# Altium schematic sheet Power.SchDoc
size A; SheetNumber: 4; SheetTotal: 10
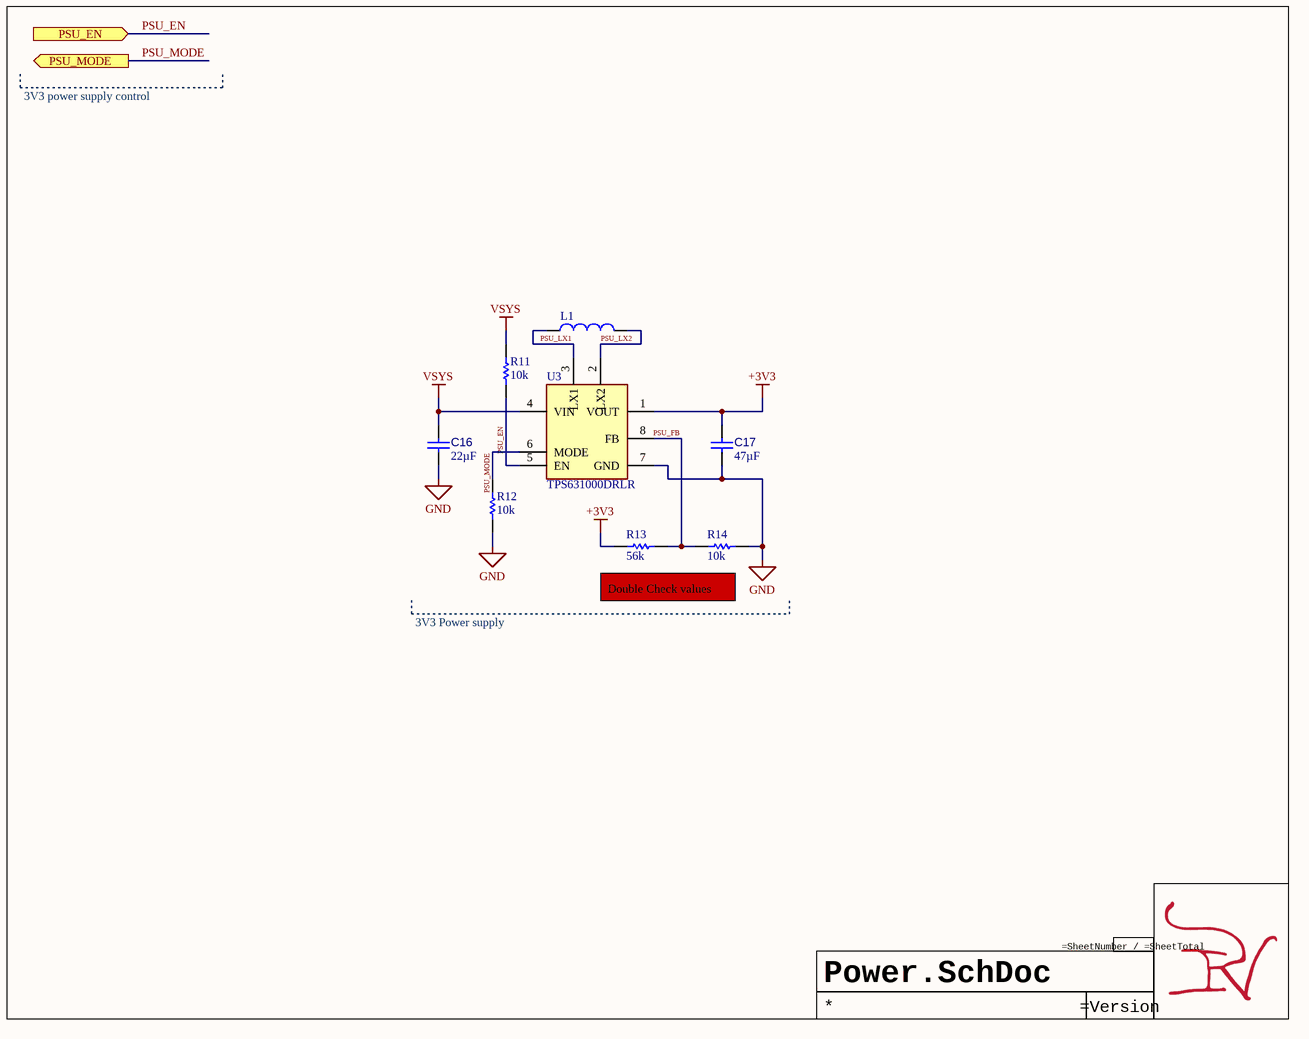
[diagram p0: Power.SchDoc]

## Parts
C16  value 22µF  [CAP 0603_1608]  (hidden comment: CL10A226KQ8NRNE)
C17  value 47µF  [CAP 0805_2012]  (hidden comment: CL21A476MQYNNNE)
L1  CIGT252010EH1R0MNE  [FP-CIGT252010EH1R0MNE-MFG]  (value not drawn)
R11  value 10k  [RES 0201_0603]  (hidden comment: 10k-0201-0.05/1)
R12  value 10k  [RES 0201_0603]  (hidden comment: 10k-0201-0.05/1)
R13  value 56k  [RES 0201_0603]  (hidden comment: 56k-0204-0.05/1)
R14  value 10k  [RES 0201_0603]  (hidden comment: 10k-0201-0.05/1)
U3  TPS631000DRLR  [SOTFL50P160X60-8N]

## Ports
PSU_EN (in, see 2040Macro-PCB[2C]), PSU_MODE (out, see 2040Macro-PCB[2C])

## Nets
+3V3: C17.2 R13.1 U3.1(VOUT)
GND: C16.1 C17.1 R12.2 R14.2 U3.7(GND)
VSYS: C16.2 R11.2 U3.4(VIN)
PSU_EN: R11.1 U3.5(EN) ; port PSU_EN
PSU_FB: R13.2 R14.1 U3.8(FB)
PSU_LX1: L1.1 U3.3(LX1)
PSU_LX2: L1.2 U3.2(LX2)
PSU_MODE: R12.1 U3.6(MODE) ; port PSU_MODE

## Notes on the sheet
- 3V3 power supply control
- 3V3 Power supply
- Double Check values

## Library data of the parts
C16 = CMP-001-00044-1: Ceramic Capacitor, Multilayer, Ceramic, 6.3V, 10% +Tol, 10% -Tol, X5R, 15% TC, 22uF, Surface Mount, 0603; Multilayer: Yes; Case/Package: 0603; Temperature Characteristics Code: X5R; JESD-609 Code: e3; Capacitor Type: Ceramic; Pins: 2; Rated DC Voltage (URdc): 6.3V; Package Style: SMTMeter; Reach SVHC Compliant: Yes; Height: 0.8mm; Tolerance  (fill in as +-): 10%; Terminal Finish: Nickel; Tolerance (fill in as +-): 10%; Max Operating Temperature: 85°C; Mounting Technology: Surface Mount; Dielectric Material: Ceramic; Width: 0.8mm; Length: 1.6mm; Min Operating Temperature: -55°C; Termination: Wraparound; Packaging: Tape and Reel; Package Shape: Rectangular; RoHS Compliant: Yes
C17 = CMP-001-00013-1: Ceramic Capacitor, Multilayer, Ceramic, 6.3V, 20% +Tol, 20% -Tol, X5R, 15% TC, 47uF, Surface Mount, 0805; Mounting Technology: Surface Mount; Max Operating Temperature: 85°C; Pins: 2; RoHS Compliant: Yes; Min Operating Temperature: -55°C; Capacitor Type: Ceramic; Case/Package: 0805
L1 = CMP-006-00002-1: General Purpose Inductor, 1uH, 20%, 1 Element, Metal Composite-Core, SMD; Test Frequency: 1MHz; Shielding: Unshielded; Core Material: Metal,Composite; Shape/Size Description: RECTANGULAR PACKAGE; DC Resistance (DCR): 30mR; Inductor Application: POWER INDUCTOR; Channels: 1; Max Current Rating: 4.1A; Termination: Wraparound; RoHS Compliant: Yes; Terminal Placement: Dual Ended; Surface Mount: Yes; Pins: 2; Max Operating Temperature: 125°C; Reach SVHC Compliant: Yes; Inductance-Nom (L): 1uH; Inductor Type: GENERAL PURPOSE INDUCTOR; Tolerance: 20%; Min Operating Temperature: -40°C
R11 R12 R14 = CMP-009-00054-1: Fixed Resistor, Metal Glaze/thick Film, 0.05W, 10000ohm, 25V, 1% +/-Tol, 200ppm/Cel, Surface Mount, 0201; Rated Temperature: 70°C; Power: 50mW; Package Height: 0.23mm; Temperature Coefficient: 200ppm/°C; Package Width: 0.3mm; Reference Standard: AEC-Q200; Package Length: 0.6mm; RoHS Compliant: Yes; JESD-609 Code: e3; Resistor Type: FIXED RESISTOR; Termination: Wraparound; Pins: 2; Technology: METAL GLAZE/THICK FILM; Terminal Finish: Nickel; Mounting Technology: Surface Mount; Package Shape: Rectangular; Reach SVHC Compliant: Yes; Package Style: SMTMeter; Case/Package: 0201; Working Voltage: 25V; Packaging: Tape and Reel; Construction: Rectangular; Max Operating Temperature: 125°C; Min Operating Temperature: -55°C; Tolerance: 1%
R13 = CMP-009-00056-1: Fixed Resistor, Metal Glaze/thick Film, 0.05W, 56000ohm, 25V, 1% +/-Tol, 200ppm/Cel, Surface Mount, 0201; Package Width: 0.3mm; Package Length: 0.6mm; Package Height: 0.23mm; Temperature Coefficient: 200ppm/°C; Reference Standard: AEC-Q200; Rated Temperature: 70°C; Power: 50mW; Resistor Type: FIXED RESISTOR; Construction: Rectangular; RoHS Compliant: Yes; Technology: METAL GLAZE/THICK FILM; Pins: 2; Tolerance: 1%; Termination: Wraparound; Max Operating Temperature: 125°C; Case/Package: 0201; Terminal Finish: Nickel; Min Operating Temperature: -55°C; Package Shape: Rectangular; Packaging: Tape and Reel; Working Voltage: 25V; Package Style: SMTMeter; Reach SVHC Compliant: Yes; JESD-609 Code: e3; Mounting Technology: Surface Mount
U3 = CMP-702-000002-3: 1.5-A output current, high power density buck-boost converter 8-SOT-5X3 -40 to 125; Manufacturer_Name: Texas Instruments; Design Item ID: TPS631000DRLR; Datasheet Link: https://www.ti.com/lit/ds/symlink/tps631000.pdf?ts=1652152702265; Arrow Part Number: TPS631000DRLR; Manufacturer_Part_Number: TPS631000DRLR; Height: 0.6mm; Source: SamacSys.SchLib; Mouser Price/Stock: https://www.mouser.co.uk/ProductDetail/Texas-Instruments/TPS631000DRLR?qs=rSMjJ%252B1ewcRYwoN2deTeNA%3D%3D; Arrow Price/Stock: https://www.arrow.com/en/products/tps631000drlr/texas-instruments?region=nac; Mouser Part Number: 595-TPS631000DRLR